# EasyEDA schematic SCH_SD_CARD_2024-02-26.json
TITLE: Sheet_1; REV: 1.0; Date: 2024-02-26; Sheet: 1/1; Drawn By: mubashirlio; Company: Your Company
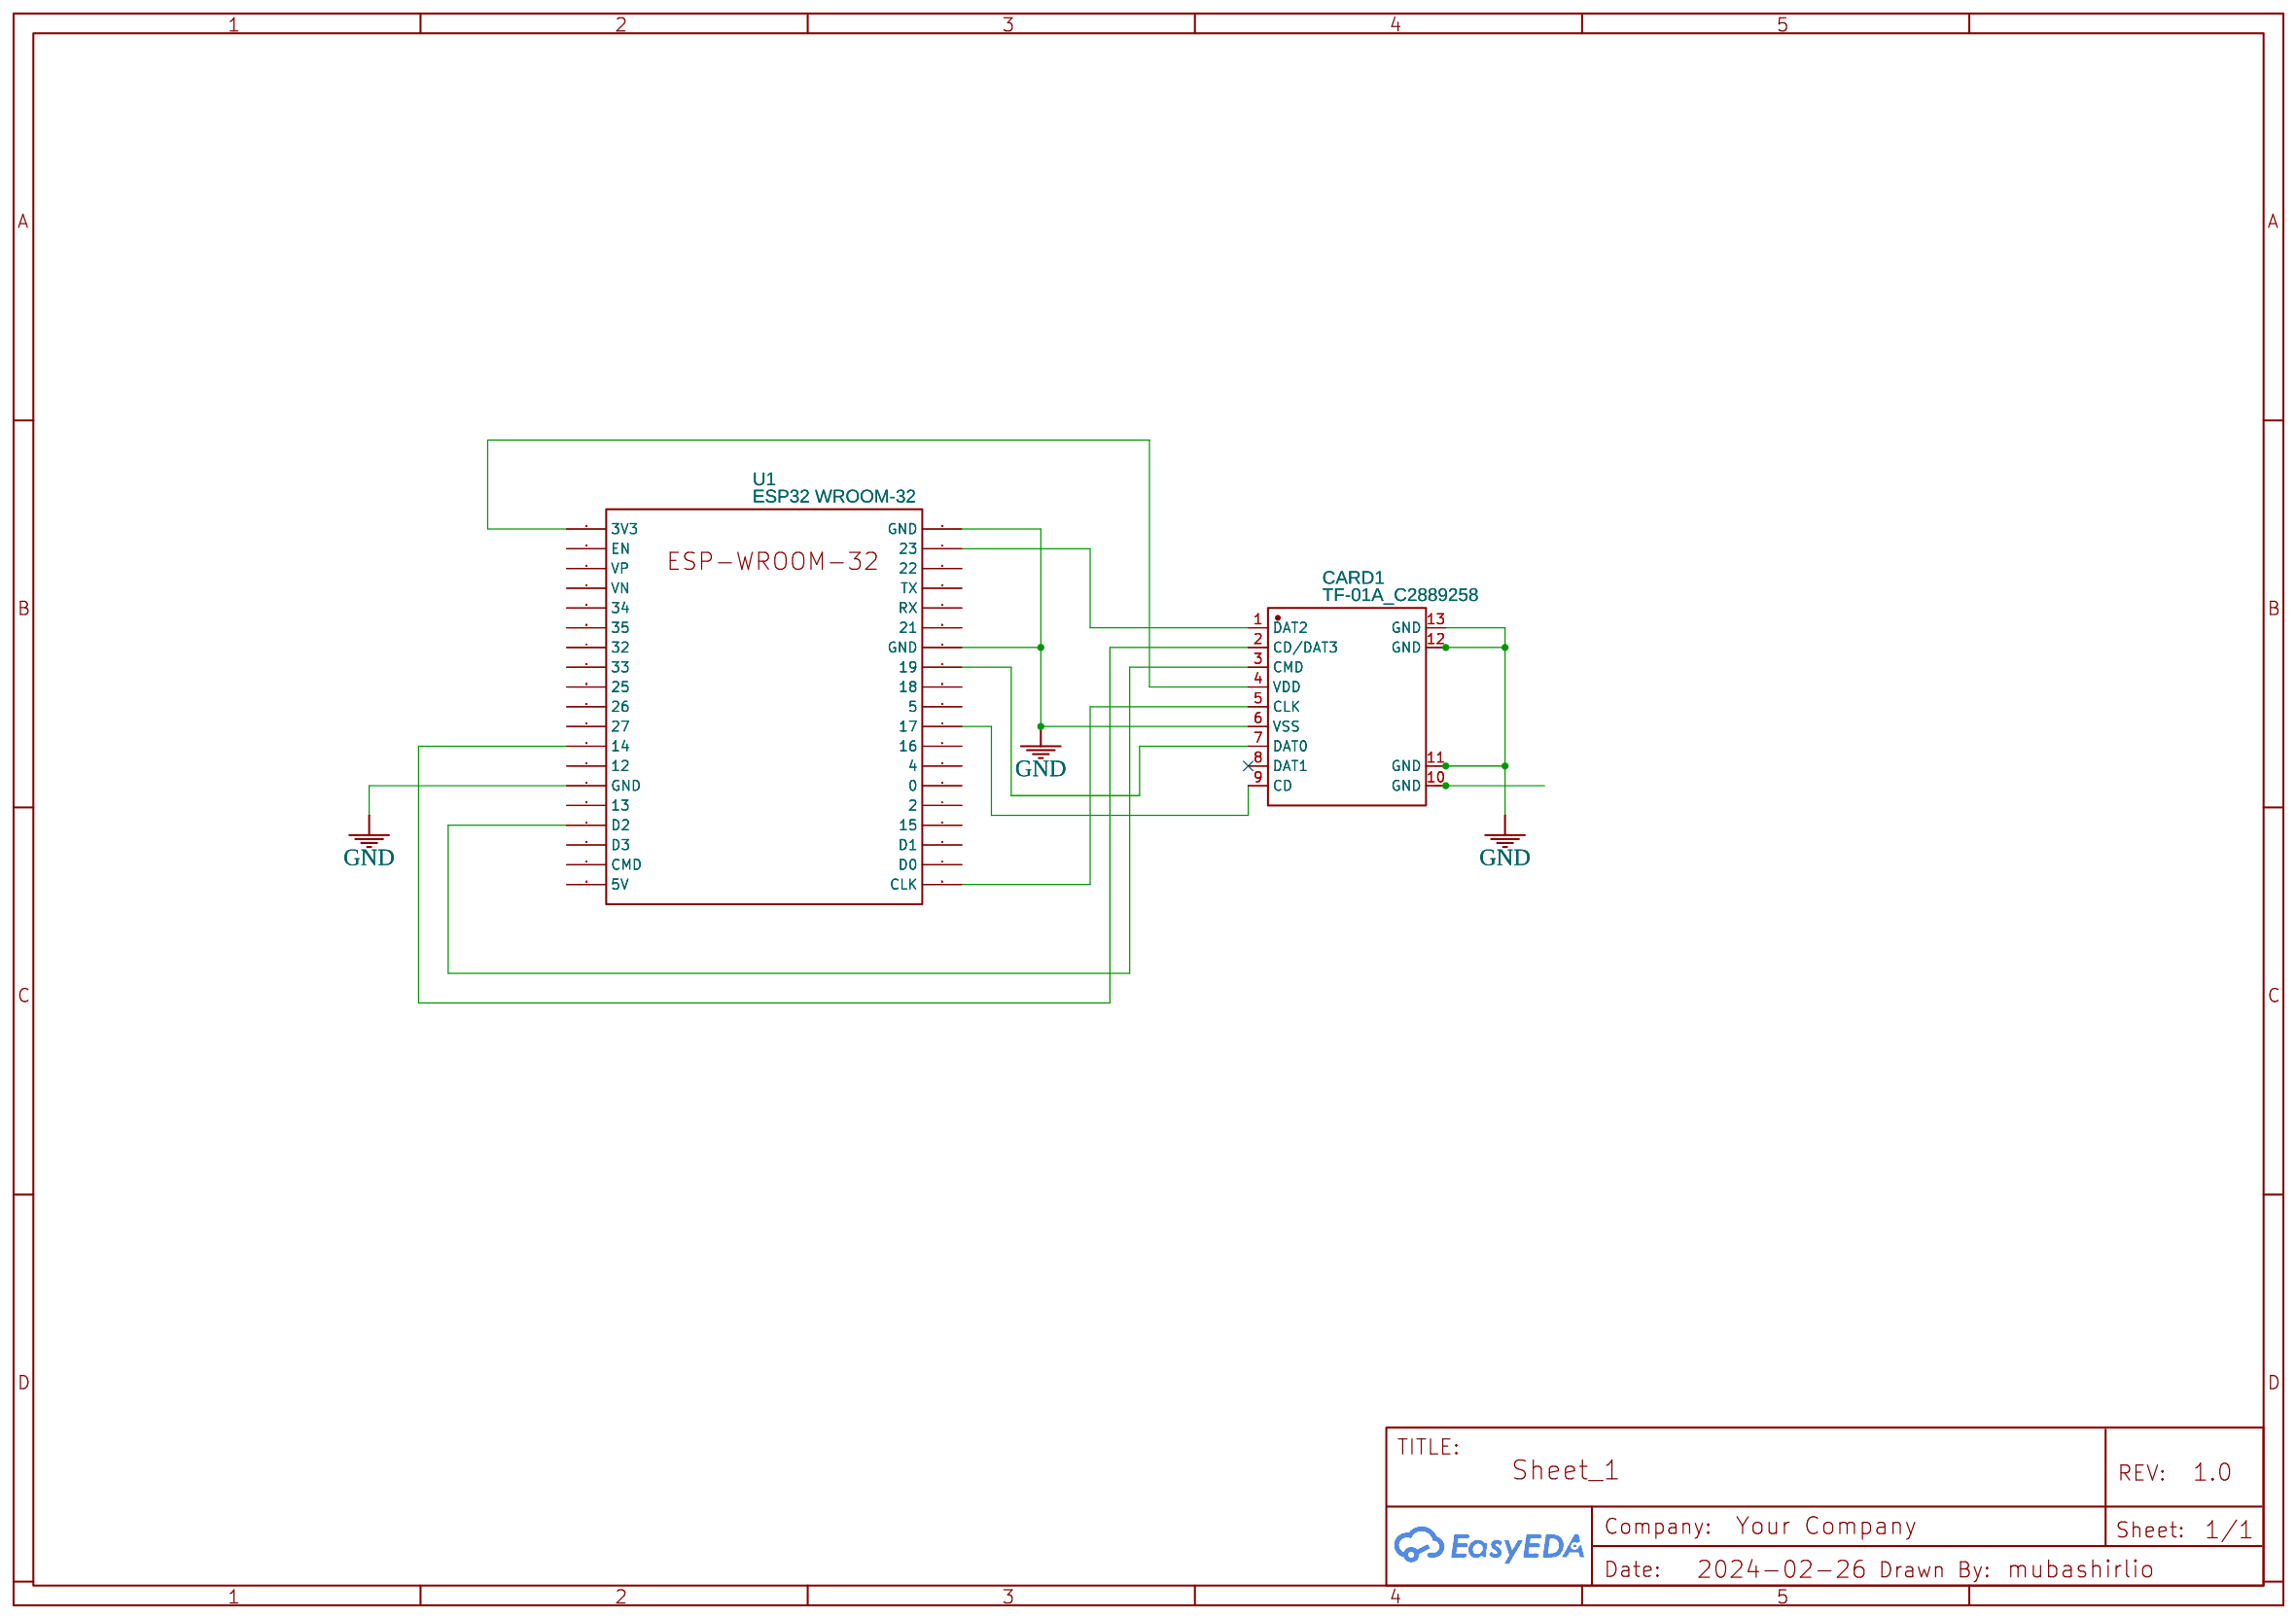
[diagram p0: schematic sheet]

## Parts
CARD1  TF-01A_C2889258  [TF-SMD_TF-02]
U1  ESP32 WROOM-32  [ESP32 WROOM-32]

## Library data of the parts
CARD1 = TF-01A_C2889258: Contributor: LCSC; Supplier: LCSC; Supplier Part: C2889258; Manufacturer: Yuandi(台湾元迪); Manufacturer Part: TF-01A; JLCPCB Part Class: Extended Part
U1 = ESP32 WROOM-32: Supplier: LCSC; Contributor: mubashirlio

## Nets
GND: CARD1.6(VSS) CARD1.11(GND) CARD1.12(GND) CARD1.13(GND) U1.14(GND) U1.32(GND) U1.38(GND)
Net-(CARD1-1): CARD1.1(DAT2) U1.37(23)
Net-(CARD1-2): CARD1.2(CD/DAT3) U1.12(14)
Net-(CARD1-3): CARD1.3(CMD) U1.16(D2)
Net-(CARD1-4): CARD1.4(VDD) U1.1(3V3)
Net-(CARD1-5): CARD1.5(CLK) U1.20(CLK)
Net-(CARD1-7): CARD1.7(DAT0) U1.31(19)
Net-(CARD1-9): CARD1.9(CD) U1.28(17)

Not connected (* = marked no-connect by the designer): CARD1 8(DAT1)* 10(GND); U1 2(EN) 3(VP) 4(VN) 5(34) 6(35) 7(32) 8(33) 9(25) 10(26) 11(27) 13(12) 15(13) 17(D3) 18(CMD) 19(5V) 21(D0) 22(D1) 23(15) 24(2) 25(0) 26(4) 27(16) 29(5) 30(18) 33(21) 34(RX) 35(TX) 36(22)
